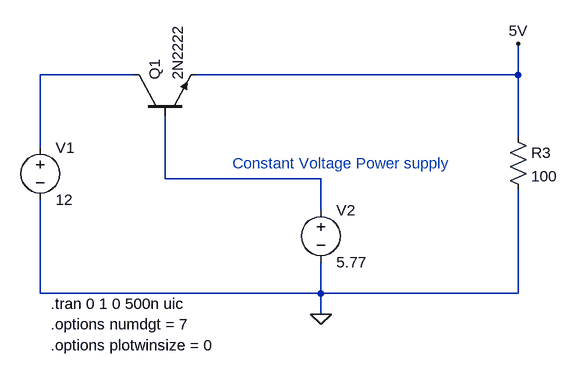
[diagram p0: schematic LDO - CVS.asc]
LDO - CVS.asc, the LTspice schematic file:
Version 4
SHEET 1 1176 680
WIRE 192 32 48 32
WIRE 784 32 784 -16
WIRE 784 32 288 32
WIRE 784 128 784 32
WIRE 48 144 48 32
WIRE 240 192 240 96
WIRE 480 192 240 192
WIRE 480 240 480 192
WIRE 48 368 48 224
WIRE 480 368 480 320
WIRE 480 368 48 368
WIRE 784 368 784 208
WIRE 784 368 480 368
WIRE 480 400 480 368
FLAG 480 400 0
FLAG 784 -16 5V
SYMBOL voltage 48 128 R0
WINDOW 123 0 0 Left 0
WINDOW 39 0 0 Left 0
SYMATTR InstName V1
SYMATTR Value 12
SYMBOL npn 192 96 R270
SYMATTR InstName Q1
SYMATTR Value 2N2222
SYMBOL voltage 480 224 R0
WINDOW 123 0 0 Left 0
WINDOW 39 0 0 Left 0
SYMATTR InstName V2
SYMATTR Value 5.77
SYMBOL res 768 112 R0
SYMATTR InstName R3
SYMATTR Value 100
TEXT 64 384 Left 2 !.tran 0 1 0 500n uic
TEXT 64 416 Left 2 !.options numdgt = 7
TEXT 64 448 Left 2 !.options plotwinsize = 0
TEXT 344 168 Left 2 ;Constant Voltage Power supply

The netlist it stands for:
* LDO - CVS.asc
V1 N001 0 12
Q1 N001 N002 5V 0 2N2222
V2 N002 0 5.77
R3 5V 0 100
.model NPN NPN
.model PNP PNP
.lib standard.bjt
.tran 0 1 0 500n uic
.options numdgt = 7
.options plotwinsize = 0
* Constant Voltage Power supply
.backanno
.end